# Altium schematic sheet POWER.SchDoc
size A4
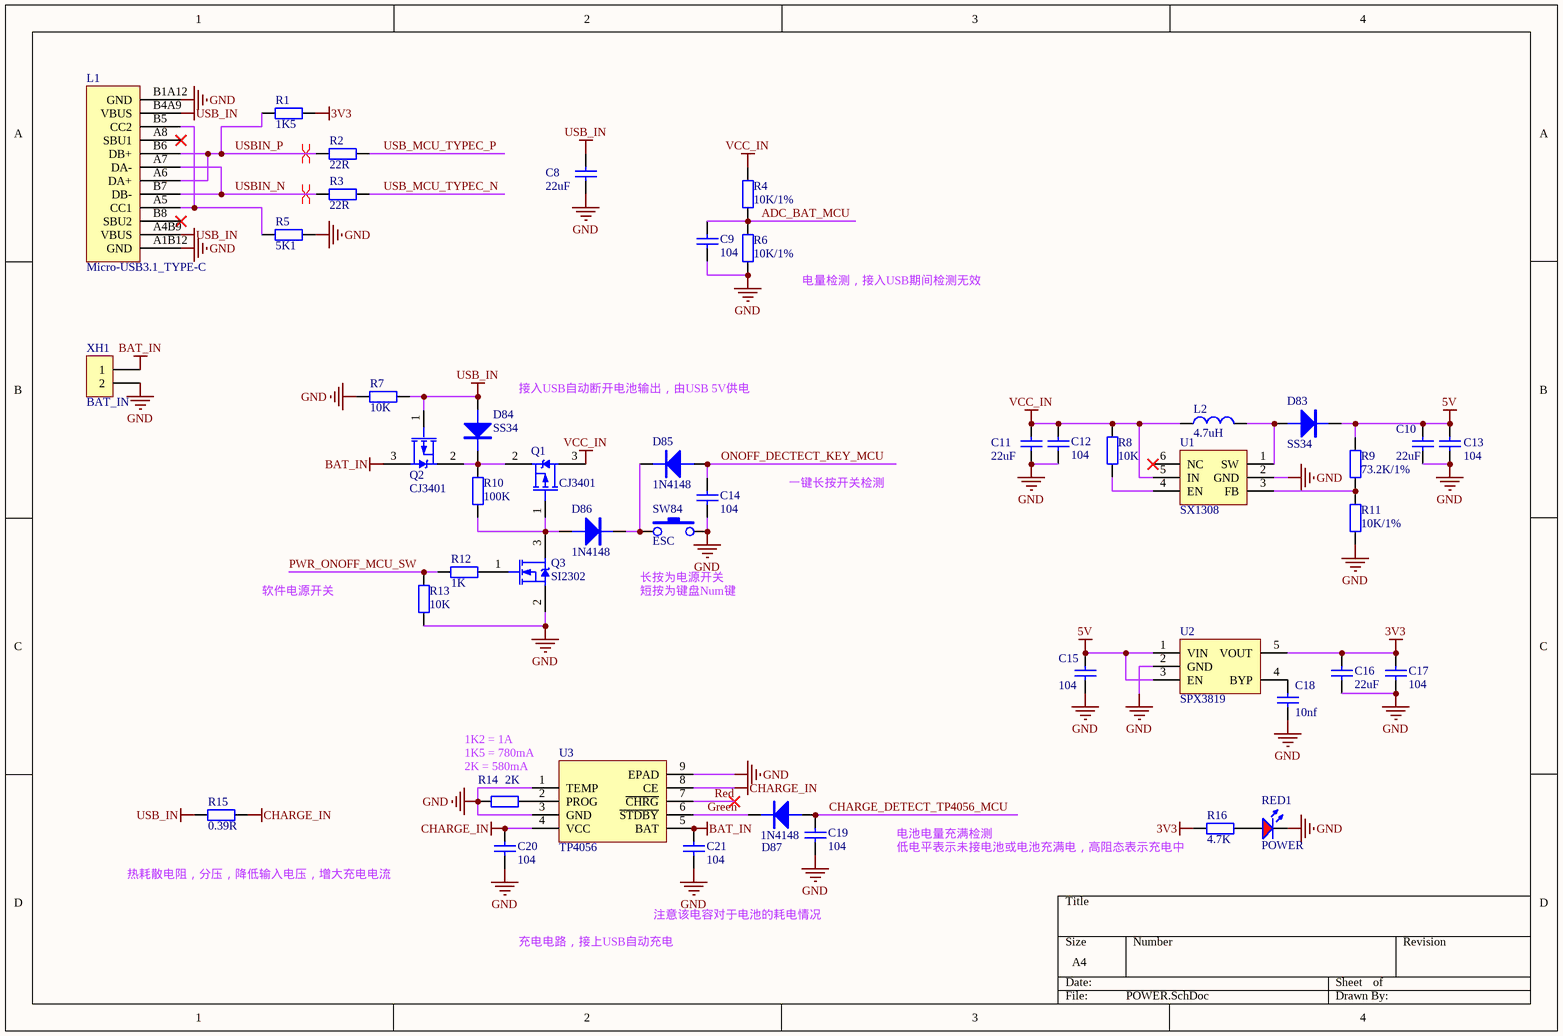
[diagram p0: POWER.SchDoc]

## Parts
C8  22uF  [Cap-0805]
C9  104  [Cap-0603]
C10  22uF  [Cap-0805]
C11  22uF  [Cap-0805]
C12  104  [Cap-0603]
C13  104  [Cap-0603]
C14  104  [Cap-0603]
C15  104  [Cap-0603]
C16  22uF  [Cap-0805]
C17  104  [Cap-0603]
C18  10nf  [Cap-0603]
C19  104  [Cap-0603]
C20  104  [Cap-0603]
C21  104  [Cap-0603]
D83  SS34  [Doide-SMA]
D84  SS34  [Doide-SMA]
D85  1N4148  [SOD-523]
D86  1N4148  [SOD-523]
D87  1N4148  [SOD-523]
L1  Micro-USB3.1_TYPE-C  [USB3.0-TYPEC-12P]
L2  4.7uH  [L-MHC0603]
Q1  CJ3401  [SOT23-3]
Q2  CJ3401  [SOT23-3]
Q3  SI2302  [SOT23-3]
R1  1K5  [Res-0603]
R2  22R  [Res-0603]
R3  22R  [Res-0603]
R4  10K/1%  [Res-0603]
R5  5K1  [Res-0603]
R6  10K/1%  [Res-0603]
R7  10K  [Res-0603]
R8  10K  [Res-0603]
R9  73.2K/1%  [Res-0603]
R10  100K  [Res-0603]
R11  10K/1%  [Res-0603]
R12  1K  [Res-0603]
R13  10K  [Res-0603]
R14  2K  [Res-0603]
R15  0.39R  [Res-1812]
R16  4.7K  [Res-0603]
RED1  POWER  [LED_0603_R]
SW84  ESC  [MX_SW-4]
U1  SX1308  [SX1308]
U2  SPX3819  [SOT23-5]
U3  TP4056  [TP4056]
XH1  BAT_IN  [XH2/2.54mm/180]

## Nets
3V3: C16.2 C17.1 R1.1 R16.2 U2.5(VOUT)
5V: C10.2 C13.2 C15.2 D83.K R9.2 U2.1(VIN) U2.3(EN)
BAT_IN: C21.2 Q2.3(D) U3.5(BAT) XH1.1
CHARGE_IN: C20.2 R15.2 U3.4(VCC) U3.8(CE)
GND: C8.1 C9.1 C10.1 C11.1 C12.1 C13.1 C14.2 C15.1 C16.1 C17.2 C18.1 C19.1 C20.1 C21.1 L1.A1B12(GND) L1.B1A12(GND) Q3.2(S) R5.1 R6.1 R7.2 R11.1 R13.2 R14.2 RED1.2(K) SW84.2 U1.2(GND) U2.2(GND) U3.1(TEMP) U3.3(GND) U3.9(EPAD) XH1.2
USB_IN: C8.2 D84.A L1.A4B9(VBUS) L1.B4A9(VBUS) Q2.1(G) R7.1 R15.1
VCC_IN: C11.2 C12.2 L2.2 Q1.3(D) R4.2 R8.1 U1.5(IN)
ADC_BAT_MCU: C9.2 R4.1 R6.2
CHARGE_DETECT_TP4056_MCU: C19.2 D87.A
Green: D87.K U3.6(~{STDBY})
ONOFF_DECTECT_KEY_MCU: C14.1 D85.A
PWR_ONOFF_MCU_SW: R12.1 R13.1
Red: U3.7(~{CHRG})
USB_MCU_TYPEC_N: R3.1
USB_MCU_TYPEC_P: R2.1
USBIN_N: L1.A7(DA-) L1.B7(DB-) R3.2
USBIN_P: L1.A6(DA+) L1.B6(DB+) R1.2 R2.2
NetC18_2: C18.2 U2.4(BYP)
NetD83_A: D83.A L2.1 U1.1(SW)
NetD84_K: D84.K Q1.2(S) Q2.2(S) R10.1
NetD85_K: D85.K D86.K SW84.1
NetD86_A: D86.A Q1.1(G) Q3.3(D) R10.2
NetL1_A5: L1.A5(CC1) L1.B5(CC2) R5.2
NetQ3_1: Q3.1(G) R12.2
NetR8_2: R8.2 U1.4(EN)
NetR9_1: R9.1 R11.2 U1.3(FB)
NetR14_1: R14.1 U3.2(PROG)
NetR16_1: R16.1 RED1.1(A)

Not connected (* = marked no-connect by the designer): L1 A8(SBU1)* B8(SBU2)*; U1 6(NC)*

## Layout directives
differential pair: USBIN_N, USBIN_P

## Notes on the sheet
- 电量检测，接入USB期间检测无效
- 接入USB自动断开电池输出，由USB 5V供电
- 一键长按开关检测
- 长按为电源开关
- 软件电源开关
- 短按为键盘Num键
- 1K2 = 1A
- 1K5 = 780mA
- 2K = 580mA
- 电池电量充满检测
- 低电平表示未接电池或电池充满电，高阻态表示充电中
- 热耗散电阻，分压，降低输入电压，增大充电电流
- 注意该电容对于电池的耗电情况
- 充电电路，接上USB自动充电

## Library data of the parts
C8-C17 C19-C21 = CAP: 贴片陶瓷电容
C18 = Cap
D83-D87 = DIODE: 普通二极管
L2 = INDUCTOR-SMD: 贴片屏蔽电感
Q1 Q2 = MOSFET-P2: P-Channel MOSFET; PackageDocument: 1995/1996; Published: 8-Jun-2000; LatestRevisionDate: 17-Jul-2002; LatestRevisionNote: Re-released for DXP Platform.; PackageReference: E3; Publisher: Altium Limited
Q3 = MOSFET-N2: N-Channel MOSFET; PackageDocument: 1995/1996; Published: 8-Jun-2000; LatestRevisionDate: 17-Jul-2002; LatestRevisionNote: Re-released for DXP Platform.; PackageReference: E3; Publisher: Altium Limited
R1-R16 = RES: 贴片电阻
RED1 = LED_SMD_RED: 发光二极管; ComponentLink1Description: 供应商链接; ComponentLink1URL: http://www.szlcsc.com/product/details_2659.html; Package: 0603; Supplier: LC; SuppliersPartNumber: C2286
SW84 = MX_SW-4: with Fixation pins  1-Pole
XH1 = XH2